# Altium project mPower.PrjPcb
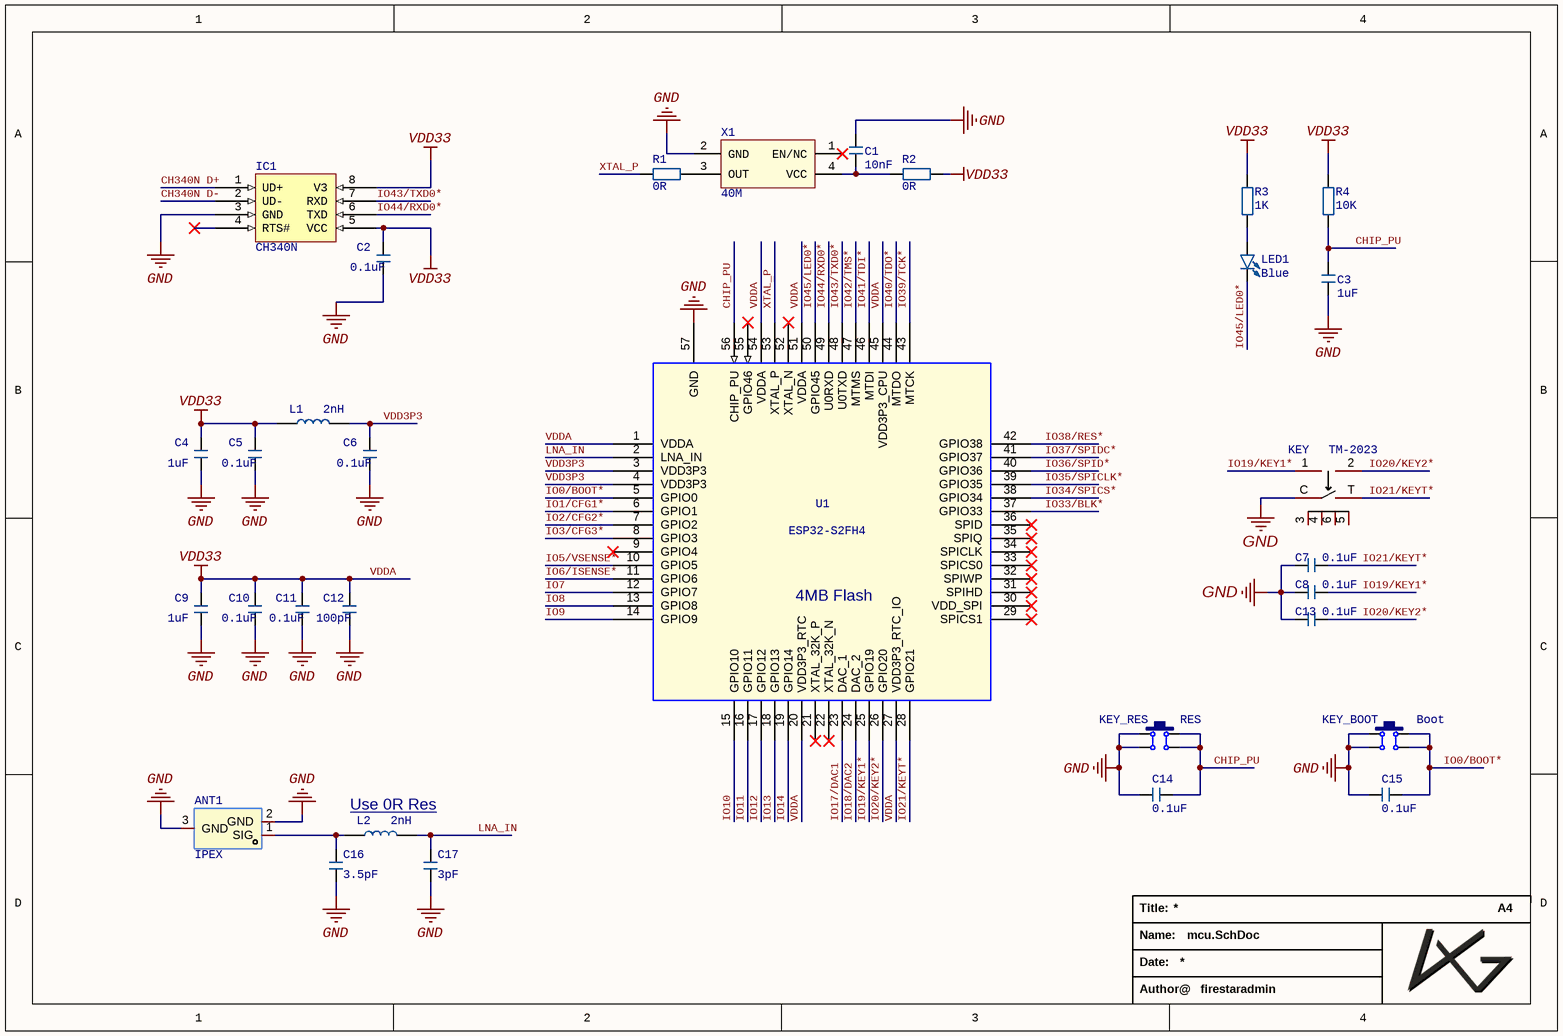
[diagram p0: mcu.SchDoc]
4 sheets, 65 parts. Net scope: global (net labels, ports and power ports of the same name join across sheets).
Board file: V1.PcbDoc
Sheets:
  mcu.SchDoc
  power.SchDoc
  interface.SchDoc
  screen.SchDoc

## Sheet mcu.SchDoc
size A4; SheetNumber: 1; SheetTotal: 4

### Parts
ANT1  IPEX  [IPEX-3Pin]
C1  10nF  [C 0603_L]
C2  0.1uF  [C 0603_L]
C3  1uF  [C 0603_L]
C4  1uF  [C 0603_L]
C5  0.1uF  [C 0603_L]
C6  0.1uF  [C 0603_L]
C7  0.1uF  [C 0603_L]
C8  0.1uF  [C 0603_L]
C9  1uF  [C 0603_L]
C10  0.1uF  [C 0603_L]
C11  0.1uF  [C 0603_L]
C12  100pF  [C 0603_L]
C13  0.1uF  [C 0603_L]
C14  0.1uF  [C 0603_L]
C15  0.1uF  [C 0603_L]
C16  3.5pF  [C 0603_L]
C17  3pF  [C 0603_L]
IC1  CH340N  [SOP8_N]
KEY  TM-2023  [TM-2023]
KEY_BOOT  Boot  [TSMD-3*4*2.5]
KEY_RES  RES  [TSMD-3*4*2.5]
L1  2nH  [L 0603-L]
L2  2nH  [L 0603-L]
LED1  Blue  [LED 0603B]
R1  0R  [R 0603_L]
R2  0R  [R 0603_L]
R3  1K  [R 0603_L]
R4  10K  [R 0603_L]
U1  ESP32-S2FH4  [QFN-56_L7.0-W7.0-P0.40-TL-EP4.0]
X1  40M  [OSC 3225-4P]

### Nets
GND: ANT1.2(GND) ANT1.3(GND) C1.2 C2.1 C3.2 C4.1 C5.1 C6.1 C7.1 C8.1 C9.1 C10.1 C11.1 C12.1 C13.1 C14.1 C15.1 C16.1 C17.1 IC1.3(GND) KEY.C KEY_BOOT.1 KEY_BOOT.2 KEY_RES.1 KEY_RES.2 U1.57(GND) X1.2(GND)
VDD33: C2.2 C4.2 C5.2 C9.2 C10.2 C11.2 C12.2 IC1.5(VCC) IC1.8(V3) L1.1 R2.2 R3.2 R4.2 U1.1(VDDA) U1.20(VDD3P3_RTC) U1.27(VDD3P3_RTC_IO) U1.45(VDD3P3_CPU) U1.51(VDDA) U1.54(VDDA)  [also labelled VDDA]
CH340N D+: IC1.1(UD+)
CH340N D-: IC1.2(UD-)
CHIP_PU: C3.1 C14.2 KEY_RES.3 KEY_RES.4 R4.1 U1.56(CHIP_PU)
IO0/BOOT*: C15.2 KEY_BOOT.3 KEY_BOOT.4 U1.5(GPIO0)
IO1/CFG1*: U1.6(GPIO1)
IO2/CFG2*: U1.7(GPIO2)
IO3/CFG3*: U1.8(GPIO3)
IO5/VSENSE*: U1.10(GPIO5)
IO6/ISENSE*: U1.11(GPIO6)
IO7: U1.12(GPIO7)
IO8: U1.13(GPIO8)
IO9: U1.14(GPIO9)
IO10: U1.15(GPIO10)
IO11: U1.16(GPIO11)
IO12: U1.17(GPIO12)
IO13: U1.18(GPIO13)
IO14: U1.19(GPIO14)
IO17/DAC1: U1.23(DAC_1)
IO18/DAC2: U1.24(DAC_2)
IO19/KEY1*: C8.2 KEY.1 U1.25(GPIO19)
IO20/KEY2*: C13.2 KEY.2 U1.26(GPIO20)
IO21/KEYT*: C7.2 KEY.T U1.28(GPIO21)
IO33/BLK*: U1.37(GPIO33)
IO34/SPICS*: U1.38(GPIO34)
IO35/SPICLK*: U1.39(GPIO35)
IO36/SPID*: U1.40(GPIO36)
IO37/SPIDC*: U1.41(GPIO37)
IO38/RES*: U1.42(GPIO38)
IO39/TCK*: U1.43(MTCK)
IO40/TDO*: U1.44(MTDO)
IO41/TDI*: U1.46(MTDI)
IO42/TMS*: U1.47(MTMS)
IO43/TXD0*: IC1.7(RXD) U1.48(U0TXD)
IO44/RXD0*: IC1.6(TXD) U1.49(U0RXD)
IO45/LED0*: LED1.2(K) U1.50(GPIO45)
LNA_IN: C17.2 L2.2 U1.2(LNA_IN)
VDD3P3: C6.2 L1.2 U1.3(VDD3P3) U1.4(VDD3P3)
XTAL_P: R1.1 U1.53(XTAL_P)
NetANT1_1: ANT1.1(SIG) C16.2 L2.1
NetC1_1: C1.1 R2.1 X1.4(VCC)
NetLED1_1: LED1.1(A) R3.1
NetR1_2: R1.2 X1.3(OUT)

Not connected (* = marked no-connect by the designer): IC1 4(RTS#)*; KEY 3 4 5 6; U1 9(GPIO4)* 21(XTAL_32K_P)* 22(XTAL_32K_N)* 29(SPICS1)* 30(VDD_SPI)* 31(SPIHD)* 32(SPIWP)* 33(SPICS0)* 34(SPICLK)* 35(SPIQ)* 36(SPID)* 52(XTAL_N)* 55(GPIO46)*; X1 1(EN/NC)*

### Notes on the sheet
- (near U1) 4MB Flash
- (near L2) Use 0R Res
- Title:
- A4
- Name:
- Date:
- Author@
- firestaradmin

### Library data of the parts
ANT1 = IPEX: IPEX 天线座子
C1-C17 = C: 无极性贴片电容; 版权归属: 源创客; BOM名称: 无极性贴片电容; 学习资源: www.ooocke.com
IC1 = CH340N: USB 转串口芯片 CH330/CH340N
KEY = TM-2023: 三角拨轮开关
KEY_BOOT KEY_RES = TS-3x4x2.5mm-4pin: TS-3x4x2.5mm-4pin 轻触按键
L1 L2 = L: 小功率贴片电感; 版权归属: 源创客; BOM名称: 小功率贴片电感; 学习资源: www.ooocke.com
LED1 = LED-SMD: 贴片LED; 版权归属: 源创客; BOM名称: 贴片LED; 学习资源: www.ooocke.com
R1-R4 = R: 贴片电阻; 版权归属: 源创客; BOM名称: 贴片电阻; 学习资源: www.ooocke.com
U1 = ESP32-S2FH4: 单核 32 位 LX7 微处理器的 SoC, 240Mhz , 4MB Flash
X1 = XTAL-ACT-4P: 4脚有源晶振; 版权归属: 源创客; BOM名称: 4脚有源晶振; 学习资源: www.ooocke.com

## Sheet power.SchDoc
size A4; SheetNumber: 2; SheetTotal: 4
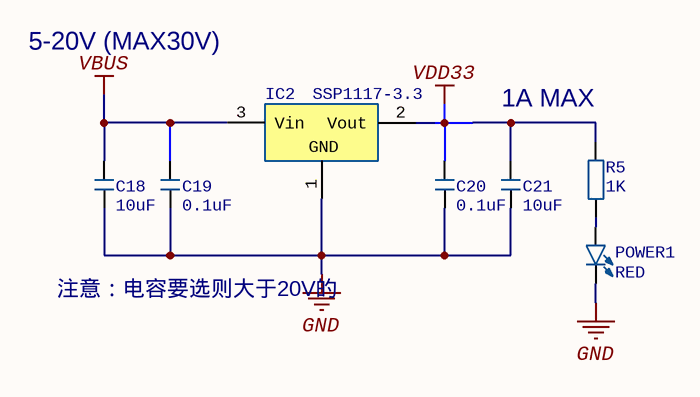
[diagram p1: power.SchDoc]

### Parts
C18  10uF  [C 0603_L]
C19  0.1uF  [C 0603_L]
C20  0.1uF  [C 0603_L]
C21  10uF  [C 0603_L]
IC2  SSP1117-3.3  [SOT223_N]
POWER1  RED  [LED 0603R]
R5  1K  [R 0603_L]

### Nets
GND: C18.1 C19.1 C20.1 C21.1 IC2.1(GND) POWER1.2(K)
VBUS: C18.2 C19.2 IC2.3(Vin)  [project net SENSE+]
VDD33: C20.2 C21.2 IC2.2(Vout) R5.2
NetPOWER1_1: POWER1.1(A) R5.1

### Notes on the sheet
- 5-20V (MAX30V)
- 1A MAX
- 注意：电容要选则大于20V的
- Title:
- A4
- Name:
- Date:
- Author@
- firestaradmin

### Library data of the parts
C18-C21 = C: 无极性贴片电容; 版权归属: 源创客; BOM名称: 无极性贴片电容; 学习资源: www.ooocke.com
IC2 = SSP1117-3.3: LDO 3.3V  1A  压差1.3V （x~20V  极限30V）
POWER1 = LED-SMD: 贴片LED; 版权归属: 源创客; BOM名称: 贴片LED; 学习资源: www.ooocke.com
R5 = R: 贴片电阻; 版权归属: 源创客; BOM名称: 贴片电阻; 学习资源: www.ooocke.com

## Sheet interface.SchDoc
size A4; SheetNumber: 3; SheetTotal: 4
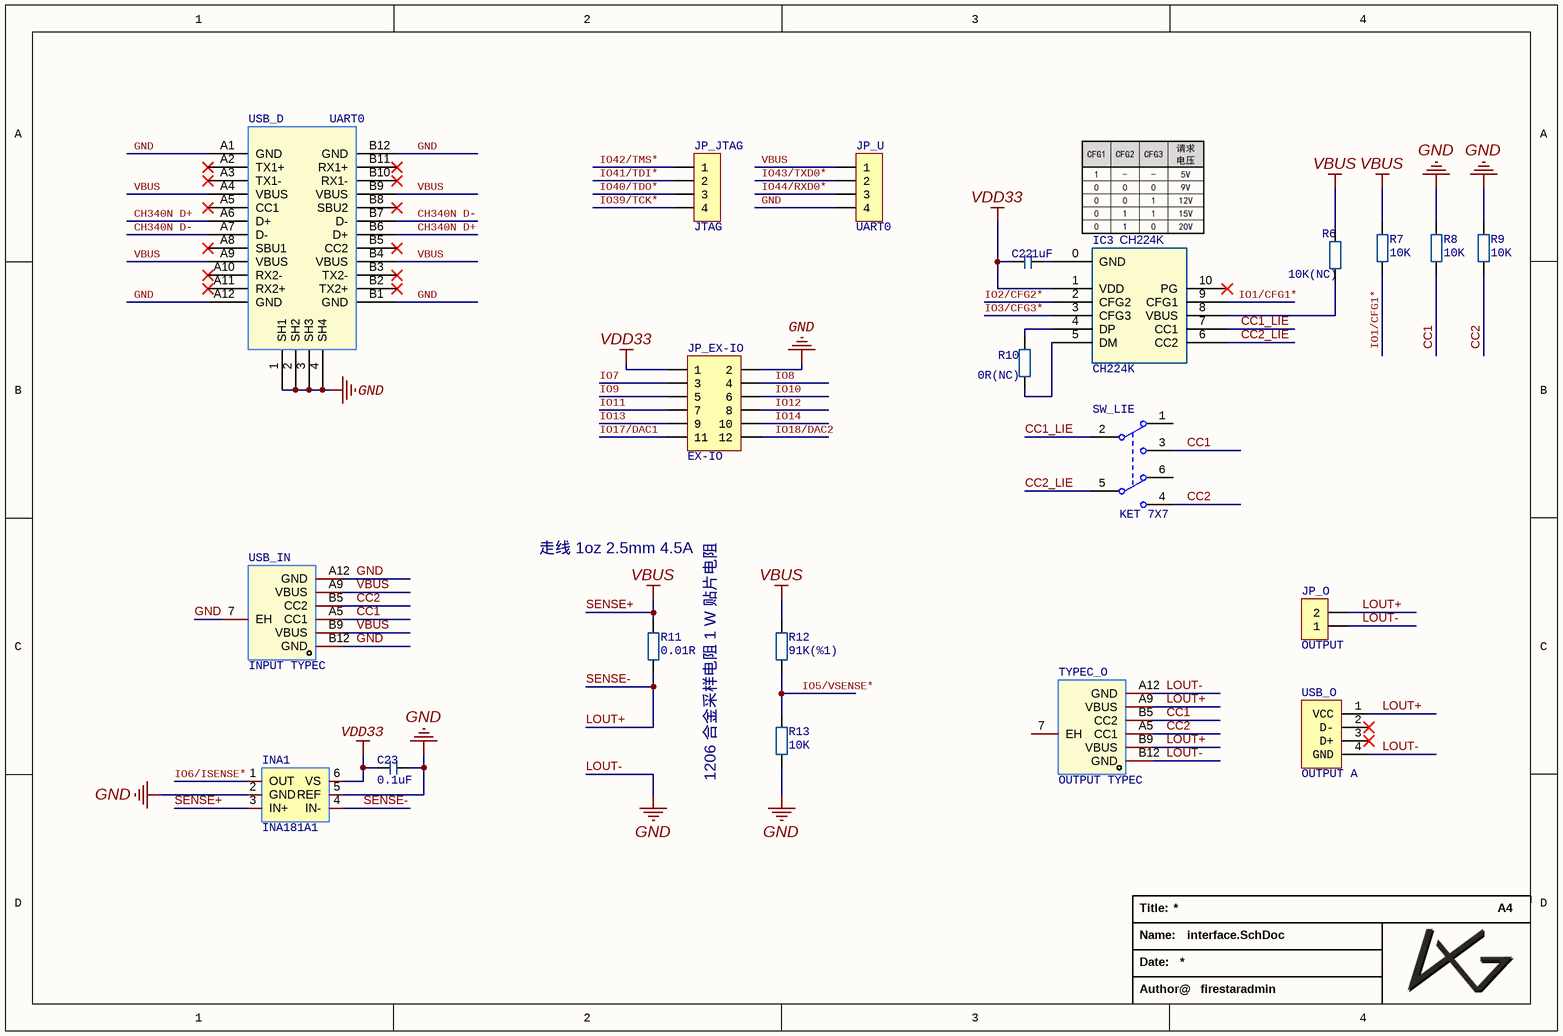
[diagram p2: interface.SchDoc]

### Parts
C22  1uF  [C 0603_L]
C23  0.1uF  [C 0603_L]
IC3  CH224K  [ESSOP10-1mm]
INA1  INA181A1  [SOT23-6L]
JP_EX-IO  EX-IO  [HDR2.54-LI-2x6P]
JP_JTAG  JTAG  [HDR2.54-LI-4P]
JP_O  OUTPUT  [KF301-5.0-2P]
JP_U  UART0  [HDR2.54-LI-4P]
R6  10K(NC)  [R 0603_L]
R7  10K  [R 0603_L]
R8  10K  [R 0603_L]
R9  10K  [R 0603_L]
R10  0R(NC)  [R 0603_L]
R11  0.01R  [R 1206_L]
R12  91K(%1)  [R 0603_L]
R13  10K  [R 0603_L]
SW_LIE  KET 7X7  [KFT DIP-7X7]
TYPEC_O  OUTPUT TYPEC  [TYPE-C-6P]
USB_D  UART0  [TYPE-C-16P]
USB_IN  INPUT TYPEC  [TYPE-C-6P]
USB_O  OUTPUT A  [USB-A/S_B]

### Nets
GND: C23.1 INA1.2(GND) INA1.5(REF) JP_EX-IO.2 JP_O.1 JP_U.4 R8.1 R9.1 R13.1 TYPEC_O.A12(GND) TYPEC_O.B12(GND) USB_D.1(SH1) USB_D.2(SH2) USB_D.3(SH3) USB_D.4(SH4) USB_D.A1(GND) USB_D.A12(GND) USB_D.B1(GND) USB_D.B12(GND) USB_IN.7(EH) USB_IN.A12(GND) USB_IN.B12(GND) USB_O.4(GND)  [also labelled LOUT-]
SENSE+: INA1.3(IN+) JP_U.1 R6.1 R7.1 R11.2 R12.2 USB_D.A4(VBUS) USB_D.A9(VBUS) USB_D.B4(VBUS) USB_D.B9(VBUS) USB_IN.A9(VBUS) USB_IN.B9(VBUS)  [also labelled VBUS]
VDD33: C22.2 C23.2 IC3.1(VDD) INA1.6(VS) JP_EX-IO.1
CC1: R8.2 SW_LIE.3(NO1) TYPEC_O.B5(CC2) USB_IN.A5(CC1)
CC1_LIE: IC3.7(CC1) SW_LIE.2(COM2)
CC2: R9.2 SW_LIE.4(NO2) TYPEC_O.A5(CC1) USB_IN.B5(CC2)
CC2_LIE: IC3.6(CC2) SW_LIE.5(COM2)
CH340N D+: USB_D.A6(D+) USB_D.B6(D+)
CH340N D-: USB_D.A7(D-) USB_D.B7(D-)
IO1/CFG1*: IC3.9(CFG1) R7.2
IO2/CFG2*: IC3.2(CFG2)
IO3/CFG3*: IC3.3(CFG3)
IO5/VSENSE*: R12.1 R13.2
IO6/ISENSE*: INA1.1(OUT)
IO7: JP_EX-IO.3
IO8: JP_EX-IO.4
IO9: JP_EX-IO.5
IO10: JP_EX-IO.6
IO11: JP_EX-IO.7
IO12: JP_EX-IO.8
IO13: JP_EX-IO.9
IO14: JP_EX-IO.10
IO17/DAC1: JP_EX-IO.11
IO18/DAC2: JP_EX-IO.12
IO39/TCK*: JP_JTAG.4
IO40/TDO*: JP_JTAG.3
IO41/TDI*: JP_JTAG.2
IO42/TMS*: JP_JTAG.1
IO43/TXD0*: JP_U.2
IO44/RXD0*: JP_U.3
LOUT+: INA1.4(IN-) JP_O.2 R11.1 TYPEC_O.A9(VBUS) TYPEC_O.B9(VBUS) USB_O.1(VCC)  [also labelled SENSE-]
NetC22_1: C22.1 IC3.0(GND)
NetIC3_4: IC3.4(DP) R10.1
NetIC3_5: IC3.5(DM) R10.2
NetIC3_8: IC3.8(VBUS) R6.2

Not connected (* = marked no-connect by the designer): IC3 10(PG)*; SW_LIE 1(NC1) 6(NC2); TYPEC_O 7(EH); USB_D A2(TX1+)* A3(TX1-)* A5(CC1)* A8(SBU1)* A10(RX2-)* A11(RX2+)* B2(TX2+)* B3(TX2-)* B5(CC2)* B8(SBU2)* B10(RX1-)* B11(RX1+)*; USB_O 2(D-)* 3(D+)*

### Notes on the sheet
- 走线 1oz 2.5mm 4.5A
- 1206 合金采样电阻 1 W 贴片电阻
- Title:
- A4
- Name:
- Date:
- Author@
- firestaradmin

### Library data of the parts
C22 C23 = C: 无极性贴片电容; 版权归属: 源创客; BOM名称: 无极性贴片电容; 学习资源: www.ooocke.com
IC3 = CH224K: 支持 4V 至 22V 输入电压 / l 支持 PD3.0/2.0，BC1.2 等快充协议 / l 支持 USB Type-C PD，支持正反插检测与自动切换 / l 支持 E-Mark 模拟，自动检测 VCONN，支持 100W 功率
INA1 = INA181A1: 电流检测
JP_EX-IO = Header  6X2: 6*2P接插件; 版权归属: 源创客; BOM名称: 6*2P接插件; 学习资源: www.ooocke.com
JP_JTAG JP_U = Header 4: 4P接插件; 版权归属: 源创客; BOM名称: 4P接插件; 学习资源: www.ooocke.com
JP_O = Header 2: 2P接插件; 版权归属: 源创客; BOM名称: 2P接插件; 学习资源: www.ooocke.com
R6-R10 R12 R13 = R: 贴片电阻; 版权归属: 源创客; BOM名称: 贴片电阻; 学习资源: www.ooocke.com
R11 = R: 1206 合金采样电阻 1 W 贴片电阻; 版权归属: 源创客; BOM名称: 贴片电阻; 学习资源: www.ooocke.com
SW_LIE = KET 7X7: 7*7自锁开关; 版权归属: 源创客; BOM名称: 7*7自锁开关; 学习资源: www.ooocke.com
TYPEC_O USB_IN = TYPE-C 6P: Manufacturer: SHOU HAN(首韩); Add into BOM: yes; Connector Type: Type-C; Gender: 母座; Number of Contacts: 6; Number of Ports: 1; Symbol: TYPE-C 6P; Device: TYPE-C 6P; LCSC Part Name: Type-C 母头 6pin简易款四脚端子SMT+DIP 停产; Supplier Part: C456012; Manufacturer Part: TYPE-C 6P; Supplier Footprint: SMD; JLCPCB Part Class: Extended Part; Datasheet: https://atta.szlcsc.com/upload/public/pdf/source/20201203/C456012_B13F72044DF846EDBE9BDD0D1D3CD166.pdf; Supplier: LCSC; Convert to PCB: yes; Standard: -; Mounting Style: 卧贴; Current Rating - Power (Max): -; Operating Temperature Range: -40~+85
USB_D = TypeC-16P: Type-C 16Pin
USB_O = USB-A/S: USB-A型母接口; 版权归属: 源创客; BOM名称: USB-A型母接口; 学习资源: www.ooocke.com

## Sheet screen.SchDoc
size A4; SheetNumber: 4; SheetTotal: 4
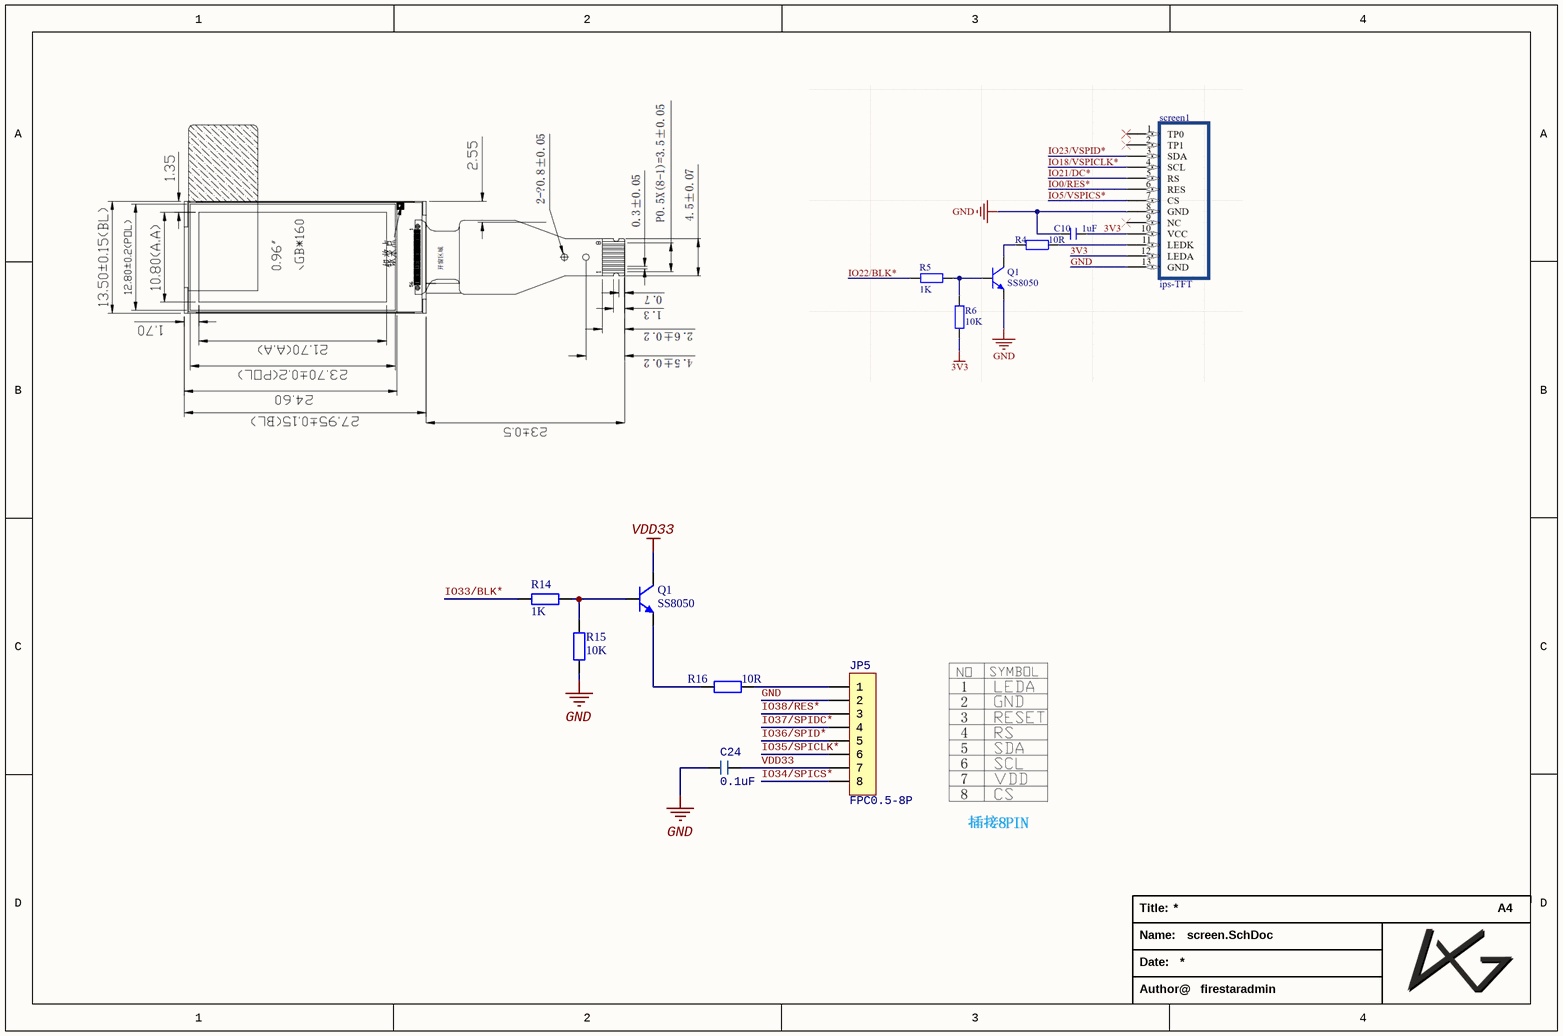
[diagram p3: screen.SchDoc]

### Parts
C24  0.1uF  [C 0603_L]
JP5  FPC0.5-8P  [FPC0.5 2H-WS-8P]
Q1  SS8050  [SOT23-3L]
R14  1K  [R 0603_L]
R15  10K  [R 0603_L]
R16  10R  [R 0603_L]

### Nets
GND: C24.1 JP5.2 R15.1
VDD33: C24.2 JP5.7 Q1.3(C)
IO33/BLK*: R14.2
IO34/SPICS*: JP5.8
IO35/SPICLK*: JP5.6
IO36/SPID*: JP5.5
IO37/SPIDC*: JP5.4
IO38/RES*: JP5.3
NetJP5_1: JP5.1 R16.1
NetQ1_1: Q1.1(B) R14.1 R15.2
NetQ1_2: Q1.2(E) R16.2

### Notes on the sheet
- Title:
- A4
- Name:
- Date:
- Author@
- firestaradmin

### Library data of the parts
C24 = C: 无极性贴片电容; 版权归属: 源创客; BOM名称: 无极性贴片电容; 学习资源: www.ooocke.com
JP5 = FPC-8P: FPC连接器; 版权归属: 源创客; BOM名称: FPC连接器; 学习资源: www.ooocke.com
Q1 = 8050-SMD: 高频放大-NPN型; 版权归属: 源创客; 属性: 40V 1.5A 1W 100MHZ; BOM名称: 高频放大-NPN型; 学习资源: www.ooocke.com
R14-R16 = R: 贴片电阻; 版权归属: 源创客; BOM名称: 贴片电阻; 学习资源: www.ooocke.com

## Nets that join several sheets
GND: mcu (27 pins), power (6 pins), interface (23 pins), screen (C24.1 JP5.2 R15.1)
SENSE+: power (C18.2 C19.2 IC2.3), interface (12 pins)
VDD33: mcu (19 pins), power (C20.2 C21.2 IC2.2 R5.2), interface (5 pins), screen (C24.2 JP5.7 Q1.3)
CH340N D+: mcu (IC1.1), interface (USB_D.A6 USB_D.B6)
CH340N D-: mcu (IC1.2), interface (USB_D.A7 USB_D.B7)
IO1/CFG1*: mcu (U1.6), interface (IC3.9 R7.2)
IO2/CFG2*: mcu (U1.7), interface (IC3.2)
IO3/CFG3*: mcu (U1.8), interface (IC3.3)
IO5/VSENSE*: mcu (U1.10), interface (R12.1 R13.2)
IO6/ISENSE*: mcu (U1.11), interface (INA1.1)
IO7: mcu (U1.12), interface (JP_EX-IO.3)
IO8: mcu (U1.13), interface (JP_EX-IO.4)
IO9: mcu (U1.14), interface (JP_EX-IO.5)
IO10: mcu (U1.15), interface (JP_EX-IO.6)
IO11: mcu (U1.16), interface (JP_EX-IO.7)
IO12: mcu (U1.17), interface (JP_EX-IO.8)
IO13: mcu (U1.18), interface (JP_EX-IO.9)
IO14: mcu (U1.19), interface (JP_EX-IO.10)
IO17/DAC1: mcu (U1.23), interface (JP_EX-IO.11)
IO18/DAC2: mcu (U1.24), interface (JP_EX-IO.12)
IO33/BLK*: mcu (U1.37), screen (R14.2)
IO34/SPICS*: mcu (U1.38), screen (JP5.8)
IO35/SPICLK*: mcu (U1.39), screen (JP5.6)
IO36/SPID*: mcu (U1.40), screen (JP5.5)
IO37/SPIDC*: mcu (U1.41), screen (JP5.4)
IO38/RES*: mcu (U1.42), screen (JP5.3)
IO39/TCK*: mcu (U1.43), interface (JP_JTAG.4)
IO40/TDO*: mcu (U1.44), interface (JP_JTAG.3)
IO41/TDI*: mcu (U1.46), interface (JP_JTAG.2)
IO42/TMS*: mcu (U1.47), interface (JP_JTAG.1)
IO43/TXD0*: mcu (IC1.7 U1.48), interface (JP_U.2)
IO44/RXD0*: mcu (IC1.6 U1.49), interface (JP_U.3)